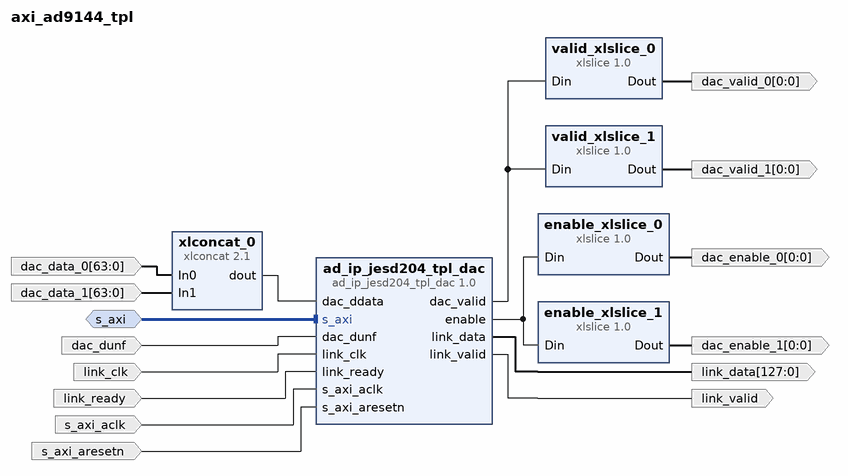
[diagram p0: block diagram of the top level]
# Vivado block design axi_ad9144_tpl, xczu7ev-fbvb900-1-e, Vivado 2022.2
create_bd_design axi_ad9144_tpl

create_bd_intf_port -mode Slave -vlnv xilinx.com:interface:aximm_rtl:1.0 s_axi
set_property -dict [list \
  CONFIG.ADDR_WIDTH 13 \
  CONFIG.ARUSER_WIDTH 0 \
  CONFIG.AWUSER_WIDTH 0 \
  CONFIG.BUSER_WIDTH 0 \
  CONFIG.DATA_WIDTH 32 \
  CONFIG.HAS_BRESP 1 \
  CONFIG.HAS_BURST 0 \
  CONFIG.HAS_CACHE 0 \
  CONFIG.HAS_LOCK 0 \
  CONFIG.HAS_PROT 1 \
  CONFIG.HAS_QOS 0 \
  CONFIG.HAS_REGION 0 \
  CONFIG.HAS_RRESP 1 \
  CONFIG.HAS_WSTRB 1 \
  CONFIG.ID_WIDTH 0 \
  CONFIG.MAX_BURST_LENGTH 1 \
  CONFIG.NUM_READ_OUTSTANDING 1 \
  CONFIG.NUM_READ_THREADS 1 \
  CONFIG.NUM_WRITE_OUTSTANDING 1 \
  CONFIG.NUM_WRITE_THREADS 1 \
  CONFIG.PROTOCOL AXI4LITE \
  CONFIG.READ_WRITE_MODE READ_WRITE \
  CONFIG.RUSER_BITS_PER_BYTE 0 \
  CONFIG.RUSER_WIDTH 0 \
  CONFIG.SUPPORTS_NARROW_BURST 0 \
  CONFIG.WUSER_BITS_PER_BYTE 0 \
  CONFIG.WUSER_WIDTH 0 \
] [get_bd_intf_ports s_axi]
create_bd_port -dir O link_valid
create_bd_port -dir O -from 127 -to 0 link_data
create_bd_port -dir I -type clk link_clk
set_property -dict {CONFIG.FREQ_HZ 100000000} [get_bd_ports link_clk]
create_bd_port -dir I link_ready
create_bd_port -dir I dac_dunf
create_bd_port -dir I -type clk s_axi_aclk
set_property -dict {CONFIG.FREQ_HZ 100000000} [get_bd_ports s_axi_aclk]
create_bd_port -dir I -type rst s_axi_aresetn
create_bd_port -dir I -from 63 -to 0 dac_data_0
create_bd_port -dir I -from 63 -to 0 dac_data_1
create_bd_port -dir O -from 0 -to 0 dac_enable_0
create_bd_port -dir O -from 0 -to 0 dac_enable_1
create_bd_port -dir O -from 0 -to 0 dac_valid_0
create_bd_port -dir O -from 0 -to 0 dac_valid_1

create_bd_cell -type ip -vlnv xilinx.com:ip:xlconcat:2.1 xlconcat_0
create_bd_cell -type ip -vlnv xilinx.com:ip:xlslice:1.0 enable_xlslice_0
set_property -dict {CONFIG.DIN_WIDTH 2} [get_bd_cells enable_xlslice_0]
create_bd_cell -type ip -vlnv xilinx.com:ip:xlslice:1.0 enable_xlslice_1
set_property -dict {CONFIG.DIN_TO 1 CONFIG.DIN_WIDTH 2} [get_bd_cells enable_xlslice_1]
create_bd_cell -type ip -vlnv xilinx.com:ip:xlslice:1.0 valid_xlslice_0
set_property -dict {CONFIG.DIN_WIDTH 2} [get_bd_cells valid_xlslice_0]
create_bd_cell -type ip -vlnv xilinx.com:ip:xlslice:1.0 valid_xlslice_1
set_property -dict {CONFIG.DIN_WIDTH 2} [get_bd_cells valid_xlslice_1]
create_bd_cell -type ip -vlnv analog.devices:user:ad_ip_jesd204_tpl_dac:1.0 ad_ip_jesd204_tpl_dac

# ---- connections ----

connect_bd_intf_net [get_bd_intf_ports s_axi] [get_bd_intf_pins ad_ip_jesd204_tpl_dac/s_axi]
connect_bd_net [get_bd_pins ad_ip_jesd204_tpl_dac/dac_valid] [get_bd_pins valid_xlslice_0/Din] [get_bd_pins valid_xlslice_1/Din]
connect_bd_net [get_bd_pins ad_ip_jesd204_tpl_dac/enable] [get_bd_pins enable_xlslice_0/Din] [get_bd_pins enable_xlslice_1/Din]
connect_bd_net [get_bd_pins ad_ip_jesd204_tpl_dac/link_data] [get_bd_ports link_data]
connect_bd_net [get_bd_pins ad_ip_jesd204_tpl_dac/link_valid] [get_bd_ports link_valid]
connect_bd_net -net dac_data_0_1 [get_bd_ports dac_data_0] [get_bd_pins xlconcat_0/In0]
connect_bd_net -net dac_data_1_1 [get_bd_ports dac_data_1] [get_bd_pins xlconcat_0/In1]
connect_bd_net [get_bd_ports dac_dunf] [get_bd_pins ad_ip_jesd204_tpl_dac/dac_dunf]
connect_bd_net [get_bd_pins enable_xlslice_0/Dout] [get_bd_ports dac_enable_0]
connect_bd_net [get_bd_pins enable_xlslice_1/Dout] [get_bd_ports dac_enable_1]
connect_bd_net [get_bd_ports link_clk] [get_bd_pins ad_ip_jesd204_tpl_dac/link_clk]
connect_bd_net [get_bd_ports link_ready] [get_bd_pins ad_ip_jesd204_tpl_dac/link_ready]
connect_bd_net [get_bd_ports s_axi_aclk] [get_bd_pins ad_ip_jesd204_tpl_dac/s_axi_aclk]
connect_bd_net [get_bd_ports s_axi_aresetn] [get_bd_pins ad_ip_jesd204_tpl_dac/s_axi_aresetn]
connect_bd_net [get_bd_pins valid_xlslice_0/Dout] [get_bd_ports dac_valid_0]
connect_bd_net [get_bd_pins valid_xlslice_1/Dout] [get_bd_ports dac_valid_1]
connect_bd_net [get_bd_pins xlconcat_0/dout] [get_bd_pins ad_ip_jesd204_tpl_dac/dac_ddata]

# ---- address map ----
assign_bd_address -offset 0x0000 -range 8K -target_address_space [get_bd_addr_spaces s_axi] [get_bd_addr_segs ad_ip_jesd204_tpl_dac/s_axi/reg0]

validate_bd_design
save_bd_design
